# EAGLE design Buggy Motor Board (EAGLE 7.2.0)
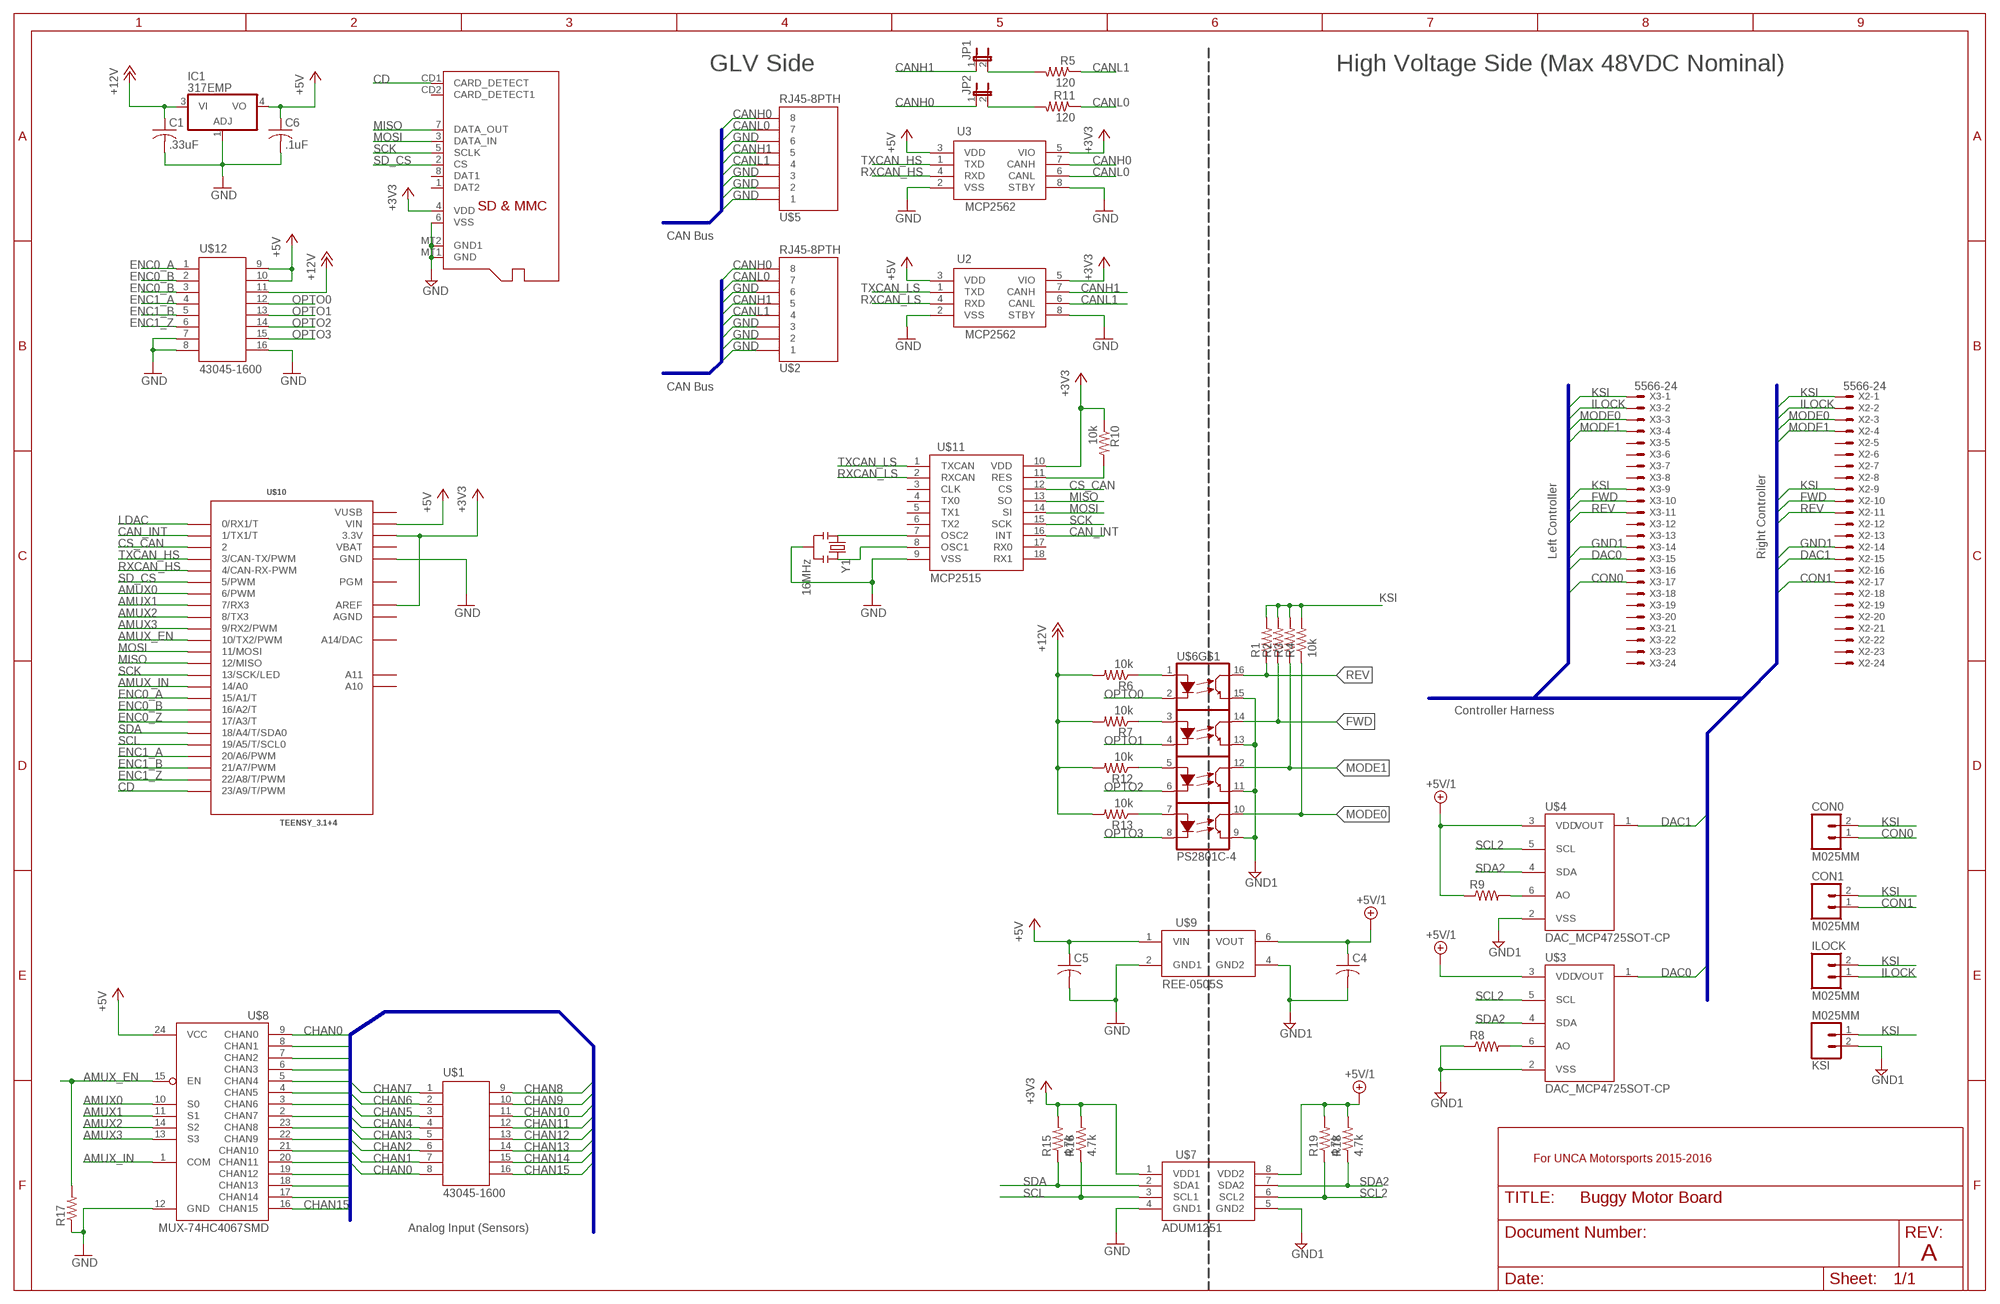
[diagram p0: schematic, sheet 1]

## Parts
C1  .33uF  C-USC0805  [C0805]
C4  C-USC1210K  [C1210K]
C5  C-USC1210K  [C1210K]
C6  .1uF  C-USC0805  [C0805]
CON0  M025MM  [SCREWTERMINAL-5MM-2]
CON1  M025MM  [SCREWTERMINAL-5MM-2]
IC1  317EMP  [SOT223]
ILOCK  M025MM  [SCREWTERMINAL-5MM-2]
JP1  JP1E  [JP1]
JP2  JP1E  [JP1]
KSI  M025MM  [SCREWTERMINAL-5MM-2]
R1  RESISTOR0805-RES  [0805]
R2  RESISTOR0805-RES  [0805]
R3  RESISTOR0805-RES  [0805]
R4  10k  RESISTOR0805-RES  [0805]
R5  120  RESISTOR0805-RES  [0805]
R6  10k  RESISTOR0805-RES  [0805]
R7  10k  RESISTOR0805-RES  [0805]
R8  RESISTOR0805-RES  [0805]
R9  RESISTOR0805-RES  [0805]
R10  10k  RESISTOR0805-RES  [0805]
R11  120  RESISTOR0805-RES  [0805]
R12  10k  RESISTOR0805-RES  [0805]
R13  10k  RESISTOR0805-RES  [0805]
R15  4.7k  RESISTOR0805-RES  [0805]
R16  4.7k  RESISTOR0805-RES  [0805]
R17  RESISTOR0805-RES  [0805]
R18  4.7k  RESISTOR0805-RES  [0805]
R19  4.7k  RESISTOR0805-RES  [0805]
U2  MCP2562  [SO08]
U3  MCP2562  [SO08]
U$1  43045-1600  [43045-1600]
U$2  RJ45-8PTH  [RJ45-8]
U$3  DAC_MCP4725SOT-CP  [SOT23-6-MCP4725]
U$4  DAC_MCP4725SOT-CP  [SOT23-6-MCP4725]
U$5  RJ45-8PTH  [RJ45-8]
U$6  PS2801C-4  [16-SOIC]
U$7  ADUM1251  [8-SOIC]
U$8  MUX-74HC4067SMD  [SSOP24]
U$9  REE-0505S  [REE-0505S]
U$10  TEENSY_3.1+4  [TEENSY_3.1+4]
U$11  MCP2515  [DIL18]
U$12  43045-1600  [43045-1600]
X1  MICROSD  [MICROSD]
X2  5566-24  [5566-24]
X3  5566-24  [5566-24]
Y1  16MHz  RESONATORPTH  [RESONATOR-PTH]

## Nets
+3V3: R10.1 R15.2 R16.2 U2.5(VIO) U3.5(VIO) U$7.1(VDD1) U$10.3.3V U$10.3.3V1(3.3V) U$10.AREF U$11.10(VDD) X1.4(VDD)
+5V: C5.1 C6.1 IC1.4(VO) U2.3(VDD) U3.3(VDD) U$8.24(VCC) U$9.1(VIN) U$10.VIN U$12.9 U$12.10
+5V/1: C4.1 R9.1 R18.2 R19.2 U$3.3(VDD) U$4.3(VDD) U$7.8(VDD2) U$9.6(VOUT)
+12V: C1.1 IC1.3(VI) R6.2 R7.2 R12.2 R13.2 U$12.11
AMUX0: U$8.10(S0) U$10.6(6/PWM)
AMUX1: U$8.11(S1) U$10.7(7/RX3)
AMUX2: U$8.14(S2) U$10.8(8/TX3)
AMUX3: U$8.13(S3) U$10.9(9/RX2/PWM)
AMUX_EN: R17.2 U$8.15(EN) U$10.10(10/TX2/PWM)
AMUX_IN: U$8.1(COM) U$10.14/A0
CAN_INT: U$10.1(1/TX1/T) U$11.16(INT)
CANH0: JP2.1 U3.7(CANH) U$2.8 U$5.8
CANH1: JP1.1 U2.7(CANH) U$2.5 U$5.5
CANL0: R11.1 U3.6(CANL) U$2.7 U$5.7
CANL1: R5.1 U2.6(CANL) U$2.4 U$5.4
CD: U$10.23/A9(23/A9/T/PWM) X1.CD1(CARD_DETECT)
CHAN0: U$1.8 U$8.9(CHAN0)
CHAN1: U$1.7 U$8.8(CHAN1)
CHAN2: U$1.6 U$8.7(CHAN2)
CHAN3: U$1.5 U$8.6(CHAN3)
CHAN4: U$1.4 U$8.5(CHAN4)
CHAN5: U$1.3 U$8.4(CHAN5)
CHAN6: U$1.2 U$8.3(CHAN6)
CHAN7: U$1.1 U$8.2(CHAN7)
CHAN8: U$1.9 U$8.23(CHAN8)
CHAN9: U$1.10 U$8.22(CHAN9)
CHAN10: U$1.11 U$8.21(CHAN10)
CHAN11: U$1.12 U$8.20(CHAN11)
CHAN12: U$1.13 U$8.19(CHAN12)
CHAN13: U$1.14 U$8.18(CHAN13)
CHAN14: U$1.15 U$8.17(CHAN14)
CHAN15: U$1.16 U$8.16(CHAN15)
CON0: CON0.1 X3.17
CON1: CON1.1 X2.17
CS_CAN: U$10.2 U$11.12(CS)
DAC0: U$3.1(VOUT) X3.15
DAC1: U$4.1(VOUT) X2.15
ENC0_A: U$10.15/A1(15/A1/T) U$12.1
ENC0_B: U$10.16/A2(16/A2/T) U$12.2
ENC0_Z: U$10.17/A3(17/A3/T) U$12.3
ENC1_A: U$10.20/A6(20/A6/PWM) U$12.4
ENC1_B: U$10.21/A7(21/A7/PWM) U$12.5
ENC1_Z: U$10.22/A8(22/A8/T/PWM) U$12.6
FWD: R2.1 U$6.14(L1) X2.10 X3.10
GND: C1.2 C5.2 C6.2 IC1.1(ADJ) R17.1 U2.2(VSS) U2.8(STBY) U3.2(VSS) U3.8(STBY) U$2.1 U$2.2 U$2.3 U$2.6 U$5.1 U$5.2 U$5.3 U$5.6 U$7.4(GND1) U$8.12(GND) U$9.2(GND1) U$10.GND U$10.GND1(GND) U$11.9(VSS) U$12.7 U$12.8 U$12.16 X1.6(VSS) X1.MT1(GND) X1.MT2(GND1) Y1.2
GND1: C4.2 KSI.2 R8.1 U$3.2(VSS) U$4.2(VSS) U$6.9(L2) U$6.11(L2) U$6.13(L2) U$6.15(L2) U$7.5(GND2) U$9.4(GND2) X2.14 X3.14
ILOCK: ILOCK.1 X2.2 X3.2
KSI: CON0.2 CON1.2 ILOCK.2 KSI.1 R1.2 R2.2 R3.2 R4.2 X2.1 X2.9 X3.1 X3.9
LDAC: U$10.0(0/RX1/T)
MISO: U$10.12(12/MISO) U$11.13(SO) X1.7(DATA_OUT)
MODE0: R4.1 U$6.10(L1) X2.3 X3.3
MODE1: R3.1 U$6.12(L1) X2.4 X3.4
MOSI: U$10.11(11/MOSI) U$11.14(SI) X1.3(DATA_IN)
N$1: JP1.2 R5.2
N$7: R8.2 U$3.6(AO)
N$8: R9.2 U$4.6(AO)
N$9: U$11.7(OSC2) Y1.1
N$10: U$11.8(OSC1) Y1.3
N$12: R6.1 U$6.1(A)
N$13: JP2.2 R11.2
N$14: R10.2 U$11.11(RES)
N$15: R7.1 U$6.3(A)
N$27: R12.1 U$6.5(A)
N$29: R13.1 U$6.7(A)
OPTO0: U$6.2(C) U$12.12
OPTO1: U$6.4(C) U$12.13
OPTO2: U$6.6(C) U$12.14
OPTO3: U$6.8(C) U$12.15
REV: R1.1 U$6.16(L1) X2.11 X3.11
RXCAN_HS: U3.4(RXD) U$10.4(4/CAN-RX-PWM)
RXCAN_LS: U2.4(RXD) U$11.2(RXCAN)
SCK: U$10.13(13/SCK/LED) U$11.15(SCK) X1.5(SCLK)
SCL: R16.1 U$7.3(SCL1) U$10.19/A5(19/A5/T/SCL0)
SCL2: R19.1 U$3.5(SCL) U$4.5(SCL) U$7.6(SCL2)
SD_CS: U$10.5(5/PWM) X1.2(CS)
SDA: R15.1 U$7.2(SDA1) U$10.18/A4(18/A4/T/SDA0)
SDA2: R18.1 U$3.4(SDA) U$4.4(SDA) U$7.7(SDA2)
TXCAN_HS: U3.1(TXD) U$10.3(3/CAN-TX/PWM)
TXCAN_LS: U2.1(TXD) U$11.1(TXCAN)
Unconnected: U$10.A10 U$10.A11 U$10.A14(A14/DAC) U$10.PGM U$11.3(CLK) U$11.4(TX0) U$11.5(TX1) U$11.6(TX2) U$11.17(RX0) U$11.18(RX1) X1.1(DAT2) X1.8(DAT1) X1.CD2(CARD_DETECT1) X2.5 X2.6 X2.7 X2.8 X2.12 X2.13 X2.16 X2.18 X2.19 X2.20 X2.21 X2.22 X2.23 X2.24 X3.5 X3.6 X3.7 X3.8 X3.12 X3.13 X3.16 X3.18 X3.19 X3.20 X3.21 X3.22 X3.23 X3.24

## Buses
CANH_HS,CANL_HS,CANH_LS,CANL_LS,GND
CHAN[0..15]
KSI,ILOCK,CON[0..1],DAC[0..1],MODE[0..1],FWD,REV,AGND,GND1

## Notes on the sheet
- GLV Side | High Voltage Side (Max 48VDC Nominal)
- CAN Bus
- CAN Bus
- Left Controller | Right Controller
- Controller Harness
- For UNCA Motorsports 2015-2016
- Analog Input (Sensors)
- A

## Power pins joined to a net without a drawn wire
AGND: U$10.AGND
VBAT: U$10.VBAT
VUSB: U$10.VUSB

## Library data of the parts
C1 C4-C6 = rcl:C-US: CAPACITOR, American symbol
CON0 CON1 ILOCK KSI = SparkFun-Connectors:M02: Standard 2-pin 0.1" header. Use with - straight break away headers ( PRT-00116) - right angle break away headers (PRT-00553) - swiss pins (PRT-00743) - machine pins (PRT-00117) - female headers (PRT-00115) Molex polarized connector foot print use with: PRT-08233 with associated crimp pins and housings. 2.54_SCREWTERM for use with PRT-10571. 3.5mm Screw Terminal footprints for PRT-08084 5mm Screw Terminal footprints for use with PRT-08433
IC1 = linear:*317: Positive VOLTAGE REGULATOR
JP1 JP2 = jumper:JP1E: JUMPER
R1-R13 R15-R19 = SparkFun-Resistors:RESISTOR: Resistor Basic schematic elements and footprints for 0603, 1206, and PTH resistors.
U2 U3 = Wetmelon-DigitalIC:MCP2562: CAN transceiver
U$1 U$12 = Wetmelon-Connectors:43045-1600: Molex Micro-Fit 3.0 Right Angle 16 Pin Header
U$2 U$5 = SparkFun-Connectors:RJ45-8: RJ45 Jack Simple RJ45, 8-pin connection - connector for common Cat5, Cat5e, and Cat6 Ethernet cables. Footprint not yet proven in production. Connector sku is PRT-00643; Breakout PCB sku is BOB-00716.
U$3 U$4 = SparkFun-AnalogIC:DAC_MCP4725: Microchip 12-bit I2C DAC, SOT23-6
U$6 = Wetmelon-DiscreteSemi:PS2801C-4: 4 Channel Optocoupler / Optoisolator
U$7 = Wetmelon-DigitalIC:ADUM1251: Dual I2C Isolator The ADuM1250/ADuM12511 are hot swappable digital isolators with nonlatching, bidirectional communication channels that are compatible with I2 C interfaces. This eliminates the need for splitting I2 C signals into separate transmit and receive signals for use with standalone optocouplers. http://www.analog.com/media/en/technical-documentation/data-sheets/ADUM1250_1251.pdf
U$8 = SparkFun-AnalogIC:MUX-74HC4067: 16-channel analog MUX
U$9 = Wetmelon-PowerIC:REE-0505S: 1 Watt Isolated DC-DC Converter 5v - 5v Isolated Switching Regulator http://www.recom-power.com/pdf/Econoline/REE.pdf
U$10 = Teensy_3_Series_Board_v1.0:TEENSY_3.1+4: Footprint for Teensy 3.1 board using all through-holes, i.e. the entire perimeter plus the 4 through-holes inboard (A10,A11,AREF, VUSB)
U$11 = Wetmelon-DigitalIC:MCP2515
X1 = adafruit:MICROSD: Micro-SD / Transflash card holder with SPI pinout For the 3M # 2908-05WB-MG and/or 4UCON #19656 push-push type
X2 X3 = con-molex:5566-24: Mini FIT connector 24 pol Source: http://www.molex.com; OC_FARNELL: unknown; OC_NEWARK: unknown
Y1 = SparkFun-FreqCtrl:RESONATOR: Resonator Small SMD resonator. Used, eg, on the Arduino Pro/ Pro Mini boards. 8MHz- XTAL-08895 16MHz- XTAL-08900

## Board
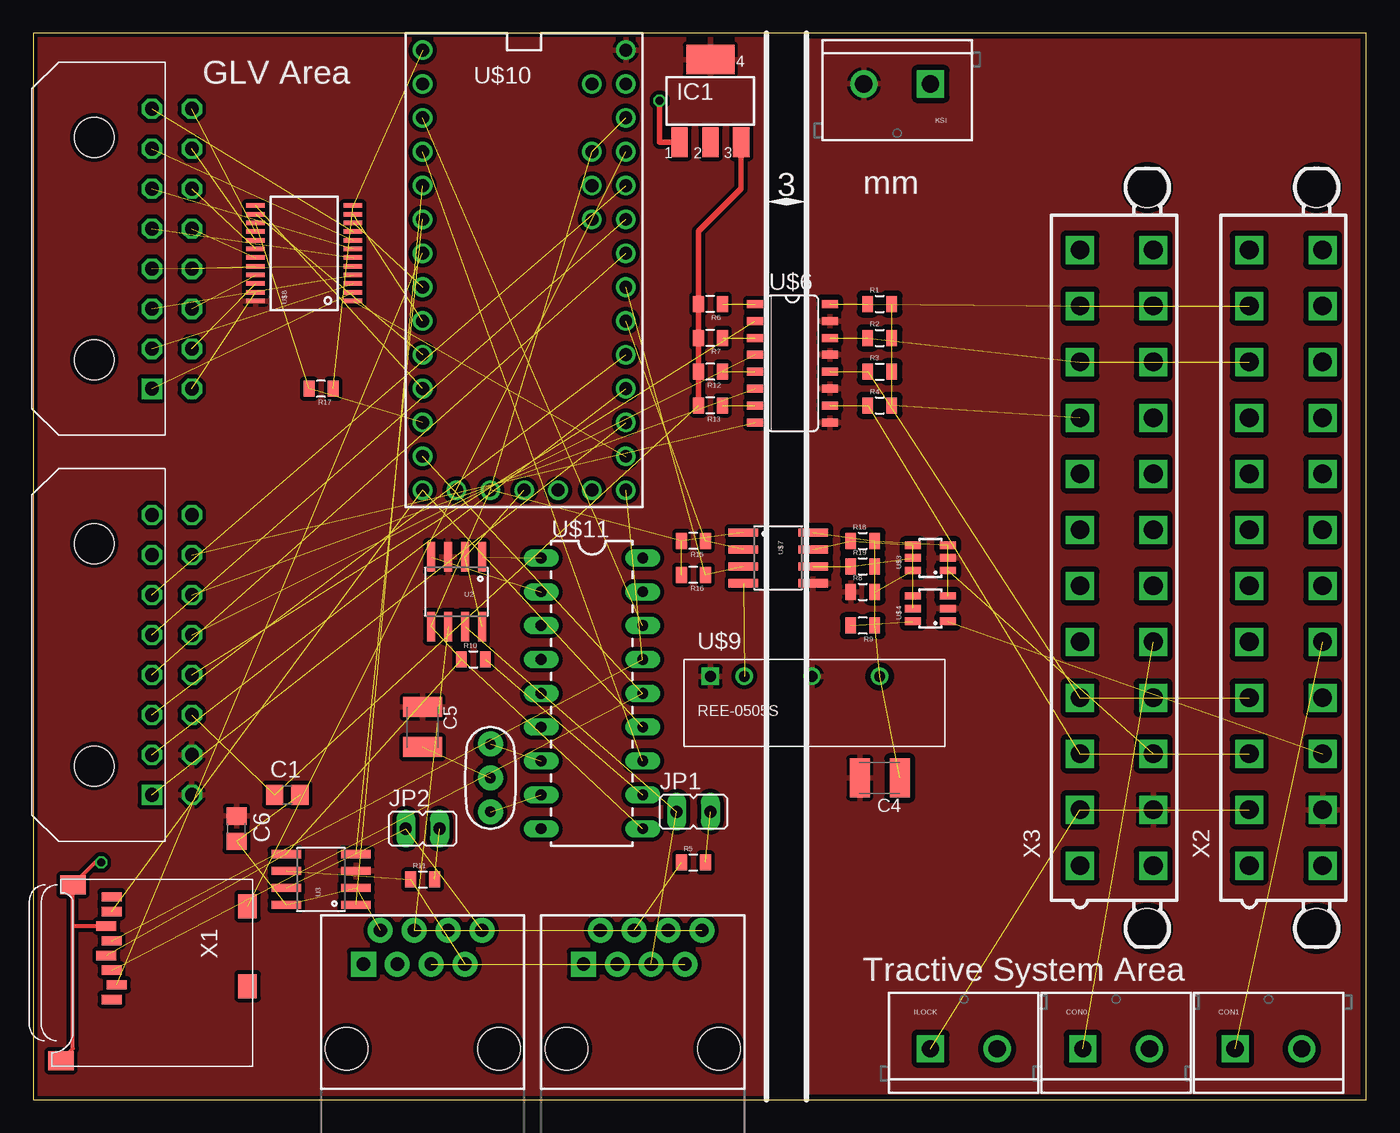
[diagram p1: board, top side]
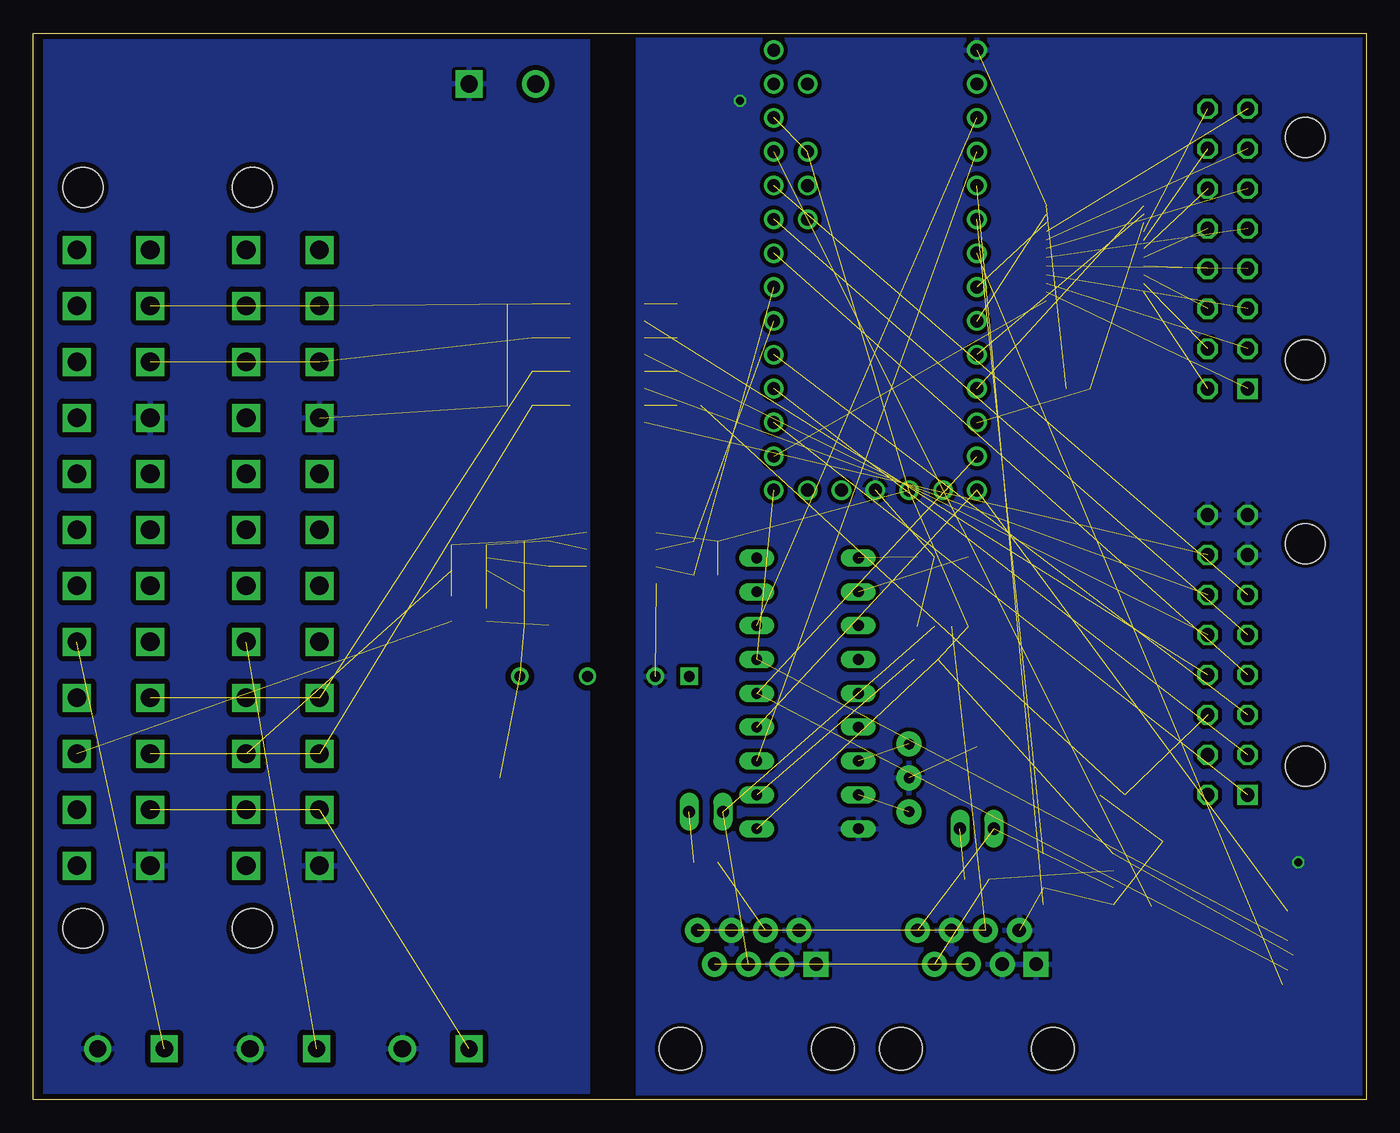
[diagram p2: board, bottom side, seen from below]

Size 100 x 80 mm. Coordinates in mm from the lower left corner, seen from the top.
Outline: 0,0 100,0 100,80 0,80 0,0
Copper layers (1*16): Top 0.035mm / dielectric 1.5mm / Bottom 0.035mm
Design rules "hackvana": minimum track width 6mil, minimum drill 0.3mm, track to track 6mil, track to pad 6mil, pad to pad 6mil, via to via 6mil, smd to smd 0mil, copper to edge 6mil, drill to drill 6mil, minimum pad ring 10mil, minimum via ring 6mil, stop-mask expansion 2mil, vias tented up to drill 100mil, thermal gap 10mil

### Footprints (pad centres in the part's own frame; a part is rotated, then mirrored left to right if it is on the bottom)
C0805 = smd 1.3 x 1.5: 1 -0.95,0; 2 0.95,0
C1210K = smd 1.5 x 2.9: 1 -1.5,0; 2 1.5,0
SCREWTERMINAL-5MM-2 = drill 1.3 pad 2.032 square: 1 0,0 | drill 1.3 pad 2.032: 2 5,0
SOT223 = smd 1.219 x 2.235: 1 -2.311,-3.099; 2 0,-3.099; 3 2.311,-3.099 | smd 3.6 x 2.2: 4 0,3.099
JP1 = drill 0.914 long: 1 0,-1.27; 2 0,1.27
0805 = smd 0.8 x 1.2: 1 -0.9,0; 2 0.9,0
SO08 = smd 0.61 x 2.21: 1 -1.905,-2.616; 2 -0.635,-2.616; 3 0.635,-2.616; 4 1.905,-2.616; 5 1.905,2.616; 6 0.635,2.616; 7 -0.635,2.616; 8 -1.905,2.616
43045-1600 = drill 1.02 square: 1 0,0 | drill 1.02 octagon: 2 -3,0; 3 -6,0; 4 -9,0; 5 -12,0; 6 -15,0; 7 -18,0; 8 -21,0; 9 0,3; 10 -3,3; 11 -6,3; 12 -9,3; 13 -12,3; 14 -15,3; 15 -18,3; 16 -21,3 | hole 3: -2.159,-4.318; -18.847,-4.318
RJ45-8 = drill 1 pad 1.88 square: 1 -4.445,6.35 | drill 1 pad 1.88: 2 -3.175,8.89; 3 -1.905,6.35; 4 -0.635,8.89; 5 0.635,6.35; 6 1.905,8.89; 7 3.175,6.35; 8 4.445,8.89 | hole 3.2: -5.715,0; 5.715,0
SOT23-6-MCP4725 = smd 0.55 x 1.2: 1 -0.95,-1.3; 2 0,-1.3; 3 0.95,-1.3; 4 0.95,1.3; 5 0,1.3; 6 -0.95,1.3
16-SOIC = smd 0.6 x 1.2: 1 -4.445,-3; 2 -3.175,-3; 3 -1.905,-3; 4 -0.635,-3; 5 0.635,-3; 6 1.905,-3; 7 3.175,-3; 8 4.445,-3; 9 4.445,2.6; 10 3.175,2.6; 11 1.905,2.6; 12 0.635,2.6; 13 -0.635,2.6; 14 -1.905,2.6; 15 -3.175,2.6; 16 -4.445,2.6
8-SOIC = smd 0.61 x 2.21: 1 -1.905,-2.616; 2 -0.635,-2.616; 3 0.635,-2.616; 4 1.905,-2.616; 5 1.905,2.616; 6 0.635,2.616; 7 -0.635,2.616; 8 -1.905,2.616
SSOP24 = smd 0.348 x 1.397: 1 -3.575,-3.656; 2 -2.925,-3.656; 3 -2.275,-3.656; 4 -1.625,-3.656; 5 -0.975,-3.656; 6 -0.325,-3.656; 7 0.325,-3.656; 8 0.975,-3.656; 9 1.625,-3.656; 10 2.275,-3.656; 11 2.925,-3.656; 12 3.575,-3.656; 13 3.575,3.656; 14 2.925,3.656; 15 2.275,3.656; 16 1.625,3.656; 17 0.975,3.656; 18 0.325,3.656; 19 -0.325,3.656; 20 -0.975,3.656; 21 -1.625,3.656; 22 -2.275,3.656; 23 -2.925,3.656; 24 -3.575,3.656
REE-0505S = drill 0.8 square: 1 0,0 | drill 0.8: 2 2.54,0; 4 7.62,0; 6 12.7,0
TEENSY_3.1+4 = drill 0.965: 0 -7.62,15.24; 1 -7.62,12.7; 2 -7.62,10.16; 3 -7.62,7.62; 3.3V 7.62,12.7; 3.3V1 -2.54,-15.24; 4 -7.62,5.08; 5 -7.62,2.54; 6 -7.62,0; 7 -7.62,-2.54; 8 -7.62,-5.08; 9 -7.62,-7.62; 10 -7.62,-10.16; 11 -7.62,-12.7; 12 -7.62,-15.24; 13 7.62,-15.24; 14/A0 7.62,-12.7; 15/A1 7.62,-10.16; 16/A2 7.62,-7.62; 17/A3 7.62,-5.08; 18/A4 7.62,-2.54; 19/A5 7.62,0; 20/A6 7.62,2.54; 21/A7 7.62,5.08; 22/A8 7.62,7.62; 23/A9 7.62,10.16; A10 5.08,7.62; A11 5.08,5.08; A14 5.08,-15.24; AGND 7.62,15.24; AREF 5.08,10.16; GND -7.62,17.78; GND1 0,-15.24; PGM 2.54,-15.24; VBAT -5.08,-15.24; VIN 7.62,17.78; VUSB 5.08,15.24
DIL18 = drill 0.813 long: 1 -10.16,-3.81; 2 -7.62,-3.81; 3 -5.08,-3.81; 4 -2.54,-3.81; 5 0,-3.81; 6 2.54,-3.81; 7 5.08,-3.81; 8 7.62,-3.81; 9 10.16,-3.81; 10 10.16,3.81; 11 7.62,3.81; 12 5.08,3.81; 13 2.54,3.81; 14 0,3.81; 15 -2.54,3.81; 16 -5.08,3.81; 17 -7.62,3.81; 18 -10.16,3.81
MICROSD = smd 0.7 x 1.5: 1 9,-10.64; 2 7.9,-10.24; 3 6.8,-10.64; 4 5.7,-11.04; 5 4.6,-10.64; 6 3.5,-11.04; 7 2.4,-10.64; 8 1.3,-10.64 | smd 1.8 x 1.4: CD1 2,-0.44; CD2 8,-0.44 | smd 1.4 x 1.9: MT1 0.4,-13.54; MT2 13.6,-14.44
5566-24 = drill 1.4 square: 1 23.1,-2.75; 2 18.9,-2.75; 3 14.7,-2.75; 4 10.5,-2.75; 5 6.3,-2.75; 6 2.1,-2.75; 7 -2.1,-2.75; 8 -6.3,-2.75; 9 -10.5,-2.75; 10 -14.7,-2.75; 11 -18.9,-2.75; 12 -23.1,-2.75; 13 23.1,2.75; 14 18.9,2.75; 15 14.7,2.75; 16 10.5,2.75; 17 6.3,2.75; 18 2.1,2.75; 19 -2.1,2.75; 20 -6.3,2.75; 21 -10.5,2.75; 22 -14.7,2.75; 23 -18.9,2.75; 24 -23.1,2.75 | hole 3: 27.8,2.29; -27.8,2.29
RESONATOR-PTH = drill 0.8 pad 1.88: 1 -2.54,0; 2 0,0; 3 2.54,0

### Placement (x,y rotation side)
C1  19.05,22.86 0 top
C4  63.5,24.13 180 top
C5  29.21,27.94 270 top
C6  15.24,20.32 270 top
CON0  78.74,3.81 0 top
CON1  90.17,3.81 0 top
IC1  50.8,74.93 0 top
ILOCK  67.31,3.81 0 top
JP1  49.53,21.59 270 top
JP2  29.21,20.32 270 top
KSI  67.31,76.2 180 top
R1  63.5,59.69 0 top
R2  63.5,57.15 0 top
R3  63.5,54.61 0 top
R4  63.5,52.07 0 top
R5  49.53,17.78 0 top
R6  50.8,59.69 180 top
R7  50.8,57.15 180 top
R8  62.23,38.1 0 top
R9  62.23,35.56 180 top
R10  33.02,33.02 0 top
R11  29.21,16.51 0 top
R12  50.8,54.61 180 top
R13  50.8,52.07 180 top
R15  49.53,41.91 180 top
R16  49.53,39.37 180 top
R17  21.59,53.34 180 top
R18  62.23,41.91 0 top
R19  62.23,40.01 0 top
U2  31.75,38.1 180 top
U3  21.59,16.51 90 top
U$1  8.89,53.34 270 top
U$2  45.72,3.81 0 top
U$3  67.31,40.64 90 top
U$4  67.31,36.83 90 top
U$5  29.21,3.81 0 top
U$6  57.15,55.24 270 top
U$7  55.88,40.64 270 top
U$8  20.32,63.5 90 top
U$9  50.8,31.75 0 top
U$10  36.83,60.96 0 top
U$11  41.91,30.48 270 top
U$12  8.89,22.86 270 top
X1  16.51,16.51 270 top
X2  93.98,40.64 270 top
X3  81.28,40.64 270 top
Y1  34.29,24.13 270 top

### Tracks (layer width: path | path; a pad name or v marks a point on that pad's centre or on a via)
+3V3  (10 unrouted)
+5V
  pour Top (isolate 0.305, rank 6): 0,80.01 54.61,80.01 54.61,0 0,0
+5V/1  (7 unrouted)
+12V  (2 unrouted)
  Top 0.406: IC1.3 53.11,68.35 49.9,65.14 R6.2 R7.2 R12.2 R13.2
AMUX0  (1 unrouted)
AMUX1  (1 unrouted)
AMUX2  (1 unrouted)
AMUX3  (1 unrouted)
AMUX_EN  (2 unrouted)
AMUX_IN  (1 unrouted)
CAN_INT  (1 unrouted)
CANH0  (3 unrouted)
CANH1  (3 unrouted)
CANL0  (3 unrouted)
CANL1  (3 unrouted)
CD  (1 unrouted)
CHAN0  (1 unrouted)
CHAN1  (1 unrouted)
CHAN2  (1 unrouted)
CHAN3  (1 unrouted)
CHAN4  (1 unrouted)
CHAN5  (1 unrouted)
CHAN6  (1 unrouted)
CHAN7  (1 unrouted)
CHAN8  (1 unrouted)
CHAN9  (1 unrouted)
CHAN10  (1 unrouted)
CHAN11  (1 unrouted)
CHAN12  (1 unrouted)
CHAN13  (1 unrouted)
CHAN14  (1 unrouted)
CHAN15  (1 unrouted)
CON0  (1 unrouted)
CON1  (1 unrouted)
CS_CAN  (1 unrouted)
DAC0  (1 unrouted)
DAC1  (1 unrouted)
ENC0_A  (1 unrouted)
ENC0_B  (1 unrouted)
ENC0_Z  (1 unrouted)
ENC1_A  (1 unrouted)
ENC1_B  (1 unrouted)
ENC1_Z  (1 unrouted)
FWD  (3 unrouted)
GND  (via drill 0.6)  (10 unrouted)
  Top 0.305: X1.MT2 2.97,3.81 2.97,13.01 | v5.08,17.78 4.64,17.78 X1.MT1 2.97,13.01 | X1.6 2.97,13.01
  Top 0.406: IC1.1 46.99,71.83 v46.99,74.93
  pour Bottom (isolate 0.305, rank 6): 0,80.01 54.61,80.01 54.61,0 0,0
GND1
  pour Top (isolate 0.406, rank 6): 58.42,80.01 100.33,80.01 100.33,0 58.42,0
ILOCK  (2 unrouted)
KSI  (4 unrouted)
  pour Bottom (isolate 0.406, rank 6): 58.42,80.01 99.06,80.01 99.06,0 58.42,0
MISO  (2 unrouted)
MODE0  (3 unrouted)
MODE1  (3 unrouted)
MOSI  (2 unrouted)
N$1  (1 unrouted)
N$7  (1 unrouted)
N$8  (1 unrouted)
N$9  (1 unrouted)
N$10  (1 unrouted)
N$12  (1 unrouted)
N$13  (1 unrouted)
N$14  (1 unrouted)
N$15  (1 unrouted)
N$27  (1 unrouted)
N$29  (1 unrouted)
OPTO0  (1 unrouted)
OPTO1  (1 unrouted)
OPTO2  (1 unrouted)
OPTO3  (1 unrouted)
REV  (3 unrouted)
RXCAN_HS  (1 unrouted)
RXCAN_LS  (1 unrouted)
SCK  (2 unrouted)
SCL  (2 unrouted)
SCL2  (3 unrouted)
SD_CS  (1 unrouted)
SDA  (2 unrouted)
SDA2  (3 unrouted)
TXCAN_HS  (1 unrouted)
TXCAN_LS  (1 unrouted)

### Text on the board
tPlace: GLV Area | mm | Tractive System Area
tDocu: Warning! | High Voltage!